# EAGLE design ft232rl (EAGLE 7.5.0)
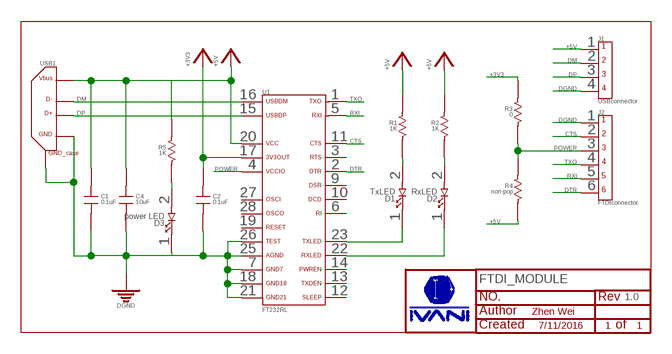
[diagram p0: schematic, sheet 1]

## Parts
C1  0.1uF  CAPACITOR_FIXED_0805  [0805]
C2  0.1uF  CAPACITOR_FIXED_0805  [0805]
C4  10uF  CAPACITOR_FIXED_0805  [0805]
D1  TxLED  LED_0805  [0805DIODE]
D2  RxLED  LED_0805  [0805DIODE]
D3  power LED  LED_0805  [0805DIODE]
FTDI_MODULE  1.0  IVANI-LABEL  [IVANI-LABEL]
J1  USBconnector  4PIN_HEADER_PITCH2.54MM_TH  [4PIN_HEADER_PITCH2.54MM_TH]
J2  FTDIconnector  6PIN_HEADER_PITCH2.54MM_TH  [6PIN_HEADER_PITCH2.54MM_TH]
R1  1K  RESISTOR_0805  [0805]
R2  1K  RESISTOR_0805  [0805]
R3  0  RESISTOR_0805  [0805]
R4  non-pop  RESISTOR_0805  [0805]
R5  1K  RESISTOR_0805  [0805]
U1  FT232RL  [SSOP-28]
USB1  USB-1.X/2.0-STANDARDTYPEA-TH  [USB-A-TH]

## Nets
+3V3: C2.1 R3.1 U1.17
+5V: C1.1 C4.1 J1.1 R1.1 R2.1 R4.2 R5.1 U1.20 USB1.1(VBUS)
CTS: J2.2 U1.11
DGND: C1.2 C2.2 C4.2 D3.1 J1.4 J2.1 U1.7 U1.18 U1.21 U1.25 U1.26 USB1.4(GND) USB1.CASE1(GND_CASE) USB1.CASE2(GND_CASE)
DM: J1.2 U1.16 USB1.2(D-)
DP: J1.3 U1.15 USB1.3(D+)
DTR: J2.6 U1.2
N$1: D1.2 R1.2
N$2: D2.2 R2.2
N$3: D3.2 R5.2
POWER: J2.3 R3.2 R4.1 U1.4
RXI: J2.5 U1.5
RXLED: D2.1 U1.22
TXLED: D1.1 U1.23
TXO: J2.4 U1.1
Unconnected: U1.3 U1.6 U1.9 U1.10 U1.12 U1.13 U1.14 U1.19 U1.27 U1.28

## Notes on the sheet
- Zhen Wei
- 7/11/2016 | 1 | 1

## Library data of the parts
C1 C2 C4 = Capacitors:CAPACITOR_FIXED
D1-D3 = ivani_lib:LED
FTDI_MODULE = ivani_lib:IVANI-LABEL
J1 = Connectors:4PIN
J2 = Connectors:6PIN
R1-R5 = Resistors:RESISTOR
U1 = ivani_lib:FT232RL
USB1 = Connectors:USB-1.X/2.0-STANDARD

## Board
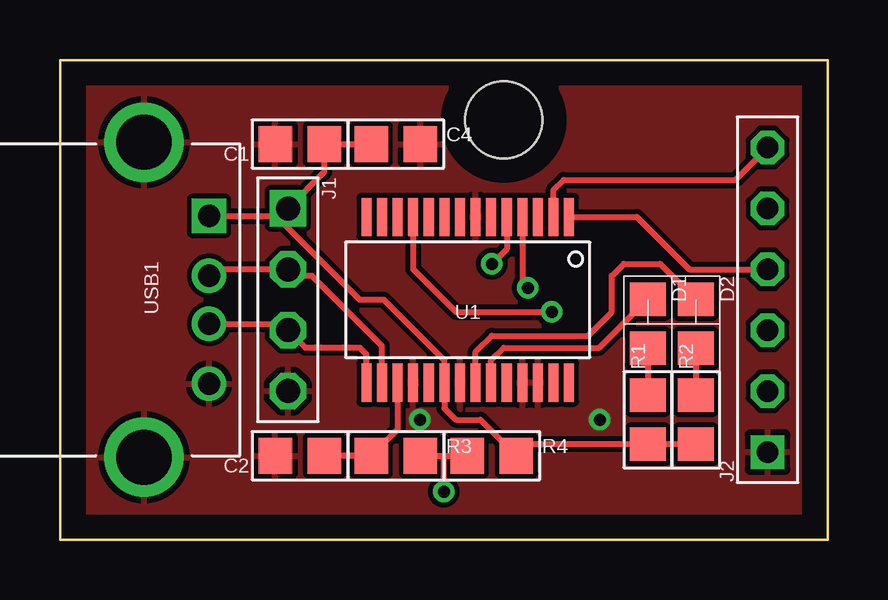
[diagram p1: board, top side]
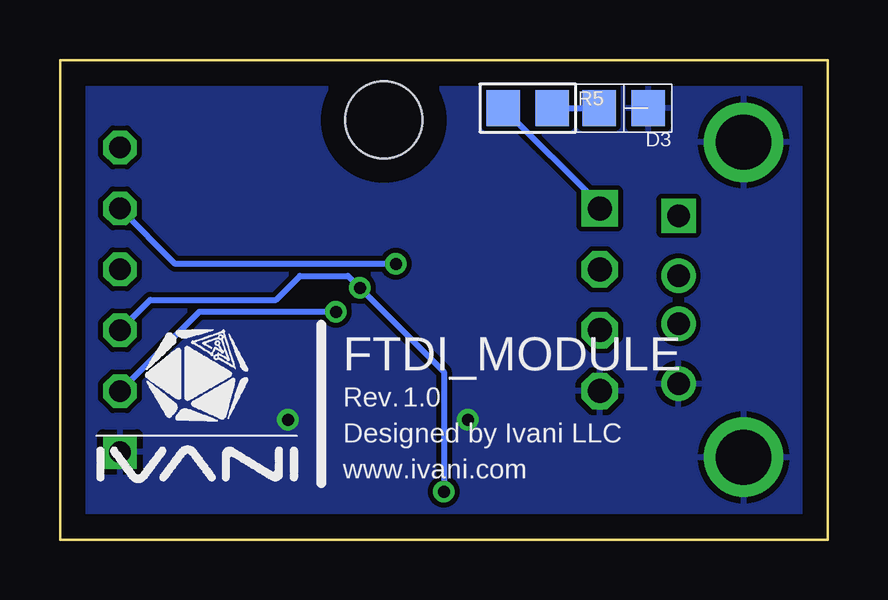
[diagram p2: board, bottom side, seen from below]

Size 32 x 20 mm. Coordinates in mm from the lower left corner, seen from the top.
Outline: 0,0 32,0 32,20 0,20 0,0
Copper layers (1*16): Top 0.035mm / dielectric 1.5mm / Bottom 0.035mm
Design rules "default": minimum track width 10mil, minimum drill 24mil, track to track 8mil, track to pad 8mil, pad to pad 8mil, via to via 8mil, smd to smd 8mil, copper to edge 40mil, drill to drill 8mil, minimum pad ring 10mil, minimum via ring 8mil, stop-mask expansion 4mil, vias tented up to drill 0mil, thermal gap 10mil
Holes 3.2 mm at 18.5,17.5

### Footprints (pad centres in the part's own frame; a part is rotated, then mirrored left to right if it is on the bottom)
0805 = smd 1.4 x 1.5: 1 -1.025,0; 2 1.025,0
0805DIODE = smd 1.4 x 1.5: 1 -1.025,0; 2 1.025,0
4PIN_HEADER_PITCH2.54MM_TH = drill 1 square: 1 -3.81,0 | drill 1 octagon: 2 -1.27,0; 3 1.27,0; 4 3.81,0
6PIN_HEADER_PITCH2.54MM_TH = drill 0.9 square: 1 -6.35,0 | drill 0.9 octagon: 2 -3.81,0; 3 -1.27,0; 4 1.27,0; 5 3.81,0; 6 6.35,0
SSOP-28 = smd 0.42 x 1.6: 1 -4.225,-3.45; 2 -3.575,-3.45; 3 -2.925,-3.45; 4 -2.275,-3.45; 5 -1.625,-3.45; 6 -0.975,-3.45; 7 -0.325,-3.45; 8 0.325,-3.45; 9 0.975,-3.45; 10 1.625,-3.45; 11 2.275,-3.45; 12 2.925,-3.45; 13 3.575,-3.45; 14 4.225,-3.45; 15 4.225,3.45; 16 3.575,3.45; 17 2.925,3.45; 18 2.275,3.45; 19 1.625,3.45; 20 0.975,3.45; 21 0.325,3.45; 22 -0.325,3.45; 23 -0.975,3.45; 24 -1.625,3.45; 25 -2.275,3.45; 26 -2.925,3.45; 27 -3.575,3.45; 28 -4.225,3.45
USB-A-TH = drill 0.92 square: 1 -3.5,2.71 | drill 0.92: 2 -1,2.71; 3 1,2.71; 4 3.5,2.71 | drill 2.3: CASE1 -6.57,0; CASE2 6.57,0

### Placement (x,y rotation side)
C1  10,16.5 180 top
C2  10,3.5 180 top
C4  14,16.5 0 top
D1  24.5,9 270 top
D2  26.5,9 270 top
D3  8.5,18 180 bottom
FTDI_MODULE  25.71,5.55 0 bottom
J1  9.5,10 270 top
J2  29.5,10 90 top
R1  24.5,5 90 top
R2  26.5,5 90 top
R3  14,3.5 0 top
R4  18,3.5 0 top
R5  12.5,18 0 bottom
U1  17,10 180 top
USB1  3.5,10 270 top

### Tracks (layer width: path | path; a pad name or v marks a point on that pad's centre or on a via)
+3V3
  Top 0.254: U1.17 14.07,4.6 R3.1 C2.1
+5V
  Top 0.254: C4.1 C1.1 11.03,15.34 J1.1 9.19,13.5 9,13.5 | USB1.1 9,13.5 | R2.1 R1.1 19.5,3.98 R4.2 17.52,5 16.5,5 16.02,5.47 U1.20 16.02,7.47 13.5,10 12.5,10 9,13.5
  Bottom 0.254: R5.1 9.5,13.97 J1.1
CTS  (via drill 0.5)
  Top 0.254: U1.11 14.72,11.28 16.5,9.5 v20.5,9.5
  Bottom 0.254: v20.5,9.5 26.19,9.5 J2.2
DGND  (via drill 0.5)
  other vias: 15,5 22.5,5
  pour Bottom: 0.5,19 0.5,1 31,1 31,19
  pour Top: 0.5,1 0.5,19 31,19 31,1
DM
  Top 0.254: U1.16 13.43,8.07 10.5,11 9.77,11 J1.2 6.48,11.27 USB1.2
DP
  Top 0.254: USB1.3 9.23,9 J1.3 10.23,8 12.5,8 12.78,7.72 U1.15
DTR
  Top 0.254: U1.2 20.57,14.57 21,15 28.15,15 J2.6
N$1
  Top 0.254: D1.2 R1.2
N$2
  Top 0.254: D2.2 R2.2
N$3
  Bottom 0.254: R5.2 D3.2
POWER  (via drill 0.5)
  Top 0.254: R3.2 16,3.5 | 16,3.5 R4.1 | U1.4 19.27,10.72 v19.5,10.5 | v16,2 16,3.5
  Bottom 0.254: v16,2 16,7 v19.5,10.5 20,11 22,11 23,10 28.23,10 J2.3
RXI  (via drill 0.5)
  Top 0.254: U1.5 18.62,12.12 v18,11.5
  Bottom 0.254: v18,11.5 27.19,11.5 J2.5
RXLED
  Top 0.254: U1.22 17.32,7.83 18,8.5 22,8.5 23,9.5 23,11 23.5,11.5 25.02,11.5 D2.1
TXLED
  Top 0.254: U1.23 17.98,7.47 18.5,8 22.48,8 D1.1
TXO
  Top 0.254: U1.1 24.05,13.45 26.23,11.27 J2.4

### Text on the board
tDocu: DTR | RX | TX | VCC | CTS | GND